# EAGLE design exixe14 (EAGLE 8.3.2)
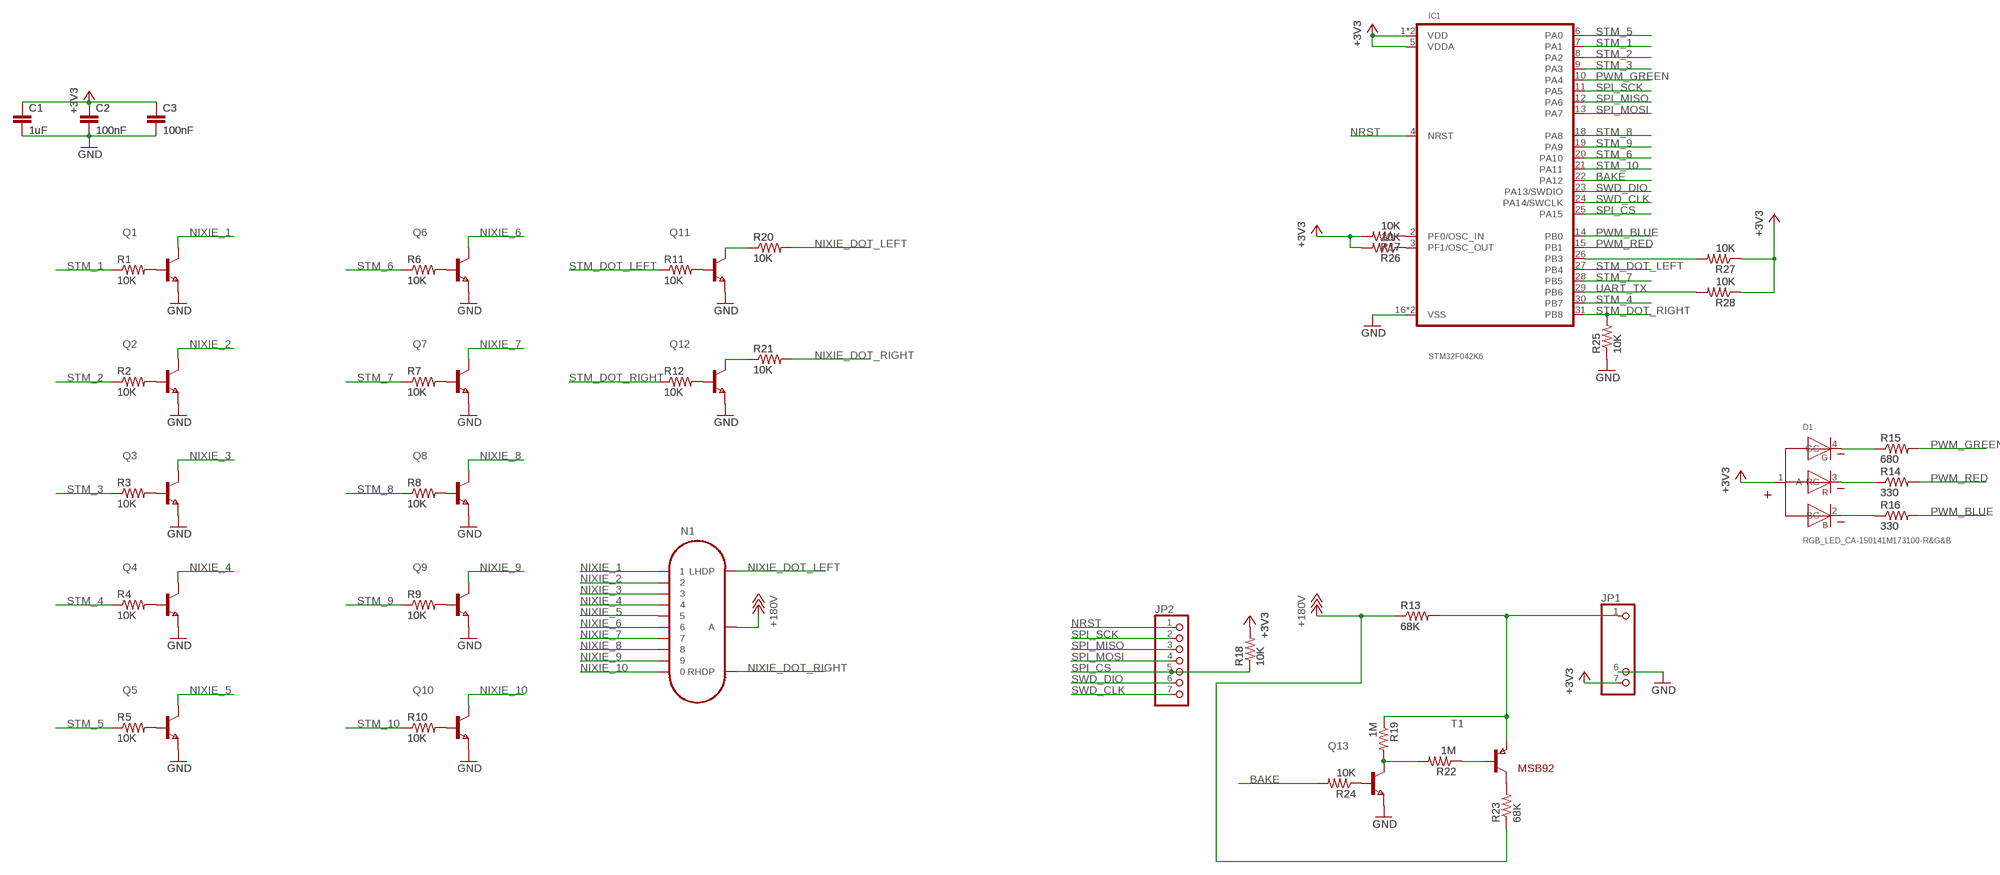
[diagram p0: schematic, sheet 1]

## Parts
C1  1uF  CAP0805  [0805]
C2  100nF  CAP0805  [0805]
C3  100nF  CAP0805  [0805]
D1  RGB_LED_CA-150141M173100-R&G&B  [3528-COMMON-ANODE]
IC1  STM32F042K6  [TQFP32-08]
JP1  PINHD-1X7  [1X07]
JP2  PINHD-1X7  [1X07]
N1  IN-14  [IN-14]
Q1  BF820  [SOT323]
Q2  BF820  [SOT323]
Q3  BF820  [SOT323]
Q4  BF820  [SOT323]
Q5  BF820  [SOT323]
Q6  BF820  [SOT323]
Q7  BF820  [SOT323]
Q8  BF820  [SOT323]
Q9  BF820  [SOT323]
Q10  BF820  [SOT323]
Q11  BF820  [SOT323]
Q12  BF820  [SOT323]
Q13  BF820  [SOT323]
R1  10K  RESISTOR0805-RES  [0805]
R2  10K  RESISTOR0805-RES  [0805]
R3  10K  RESISTOR0805-RES  [0805]
R4  10K  RESISTOR0805-RES  [0805]
R5  10K  RESISTOR0805-RES  [0805]
R6  10K  RESISTOR0805-RES  [0805]
R7  10K  RESISTOR0805-RES  [0805]
R8  10K  RESISTOR0805-RES  [0805]
R9  10K  RESISTOR0805-RES  [0805]
R10  10K  RESISTOR0805-RES  [0805]
R11  10K  RESISTOR0805-RES  [0805]
R12  10K  RESISTOR0805-RES  [0805]
R13  68K  RESISTOR0805-RES  [0805]
R14  330  RESISTOR0805-RES  [0805]
R15  680  RESISTOR0805-RES  [0805]
R16  330  RESISTOR0805-RES  [0805]
R17  10K  RESISTOR0805-RES  [0805]
R18  10K  RESISTOR0805-RES  [0805]
R19  1M  RESISTOR0805-RES  [0805]
R20  10K  RESISTOR0805-RES  [0805]
R21  10K  RESISTOR0805-RES  [0805]
R22  1M  RESISTOR0805-RES  [0805]
R23  68K  RESISTOR0805-RES  [0805]
R24  10K  RESISTOR0805-RES  [0805]
R25  10K  RESISTOR0805-RES  [0805]
R26  10K  RESISTOR0805-RES  [0805]
R27  10K  RESISTOR0805-RES  [0805]
R28  10K  RESISTOR0805-RES  [0805]
T1  PNPSOT323  [SOT323]

## Nets
+3V3: C1.1 C2.1 C3.1 D1.1(A) IC1.1(VDD) IC1.5(VDDA) IC1.17(VDD) JP1.7 R17.2 R18.2 R26.2 R27.1 R28.1
+180V: N1.A R13.1 R23.1
BAKE: IC1.22(PA12) R24.2
GND: C1.2 C2.2 C3.2 IC1.16(VSS) IC1.32(VSS) JP1.6 Q1.2(E) Q2.2(E) Q3.2(E) Q4.2(E) Q5.2(E) Q6.2(E) Q7.2(E) Q8.2(E) Q9.2(E) Q10.2(E) Q11.2(E) Q12.2(E) Q13.2(E) R25.1
N$1: Q1.1(B) R1.2
N$2: IC1.2(PF0/OSC_IN) R17.1
N$3: D1.4(GC) R15.1
N$4: Q2.1(B) R2.2
N$5: Q3.1(B) R3.2
N$6: Q4.1(B) R4.2
N$7: Q5.1(B) R5.2
N$8: Q6.1(B) R6.2
N$9: Q7.1(B) R7.2
N$10: Q8.1(B) R8.2
N$11: Q9.1(B) R9.2
N$12: Q10.1(B) R10.2
N$13: Q11.1(B) R11.2
N$14: Q12.1(B) R12.2
N$15: D1.3(RC) R14.1
N$16: IC1.3(PF1/OSC_OUT) R26.1
N$17: Q12.3(C) R21.1
N$18: Q11.3(C) R20.1
N$19: JP1.1 R13.2 R19.1 T1.3(E)
N$20: R22.1 T1.2(B)
N$21: D1.2(BC) R16.1
N$22: Q13.3(C) R19.2 R22.2
N$23: Q13.1(B) R24.1
N$24: R23.2 T1.1(C)
N$25: IC1.26(PB3) R27.2
NIXIE_1: N1.1 Q1.3(C)
NIXIE_2: N1.2 Q2.3(C)
NIXIE_3: N1.3 Q3.3(C)
NIXIE_4: N1.4 Q4.3(C)
NIXIE_5: N1.5 Q5.3(C)
NIXIE_6: N1.6 Q6.3(C)
NIXIE_7: N1.7 Q7.3(C)
NIXIE_8: N1.8 Q8.3(C)
NIXIE_9: N1.9 Q9.3(C)
NIXIE_10: N1.0 Q10.3(C)
NIXIE_DOT_LEFT: N1.LHDP R20.2
NIXIE_DOT_RIGHT: N1.RHDP R21.2
NRST: IC1.4(NRST) JP2.1
PWM_BLUE: IC1.14(PB0) R16.2
PWM_GREEN: IC1.10(PA4) R15.2
PWM_RED: IC1.15(PB1) R14.2
SPI_CS: IC1.25(PA15) JP2.5 R18.1
SPI_MISO: IC1.12(PA6) JP2.3
SPI_MOSI: IC1.13(PA7) JP2.4
SPI_SCK: IC1.11(PA5) JP2.2
STM_1: IC1.7(PA1) R1.1
STM_2: IC1.8(PA2) R2.1
STM_3: IC1.9(PA3) R3.1
STM_4: IC1.30(PB7) R4.1
STM_5: IC1.6(PA0) R5.1
STM_6: IC1.20(PA10) R6.1
STM_7: IC1.28(PB5) R7.1
STM_8: IC1.18(PA8) R8.1
STM_9: IC1.19(PA9) R9.1
STM_10: IC1.21(PA11) R10.1
STM_DOT_LEFT: IC1.27(PB4) R11.1
STM_DOT_RIGHT: IC1.31(PB8) R12.1 R25.2
SWD_CLK: IC1.24(PA14/SWCLK) JP2.7
SWD_DIO: IC1.23(PA13/SWDIO) JP2.6
UART_TX: IC1.29(PB6) R28.2

## Notes on the sheet
- MSB92

## Library data of the parts
C1-C3 = joyAnalog:CAP: Capacitor Standard 0603 ceramic capacitor, and 0.1" leaded capacitor.
D1 = nixx:RGB_LED_CA: SMD full-color TOP LED Characteristics Low energy consumption High reliability Low current requirement Fast switching No UV/IR radiation High brightness RGB individual control Compact package outline Black surface Applications Flash light Switch indicators Equipments indicators Accent and decorative lighting Electronic signage Video displays Backlight for LCDs, PDAs and TVs Oven, microwave Street lighting Ideal for lateral coupling in light guides <http://katalog.we-online.de/media/images/eipal/WL-SFTW_pf2.jpg> Details see: http://katalog.we-online.de/en/led/WL-SFTW?m Updated 2015-04-10 2015 (C) Wurth Elektronik
IC1 = nixx:STM32F042K6
JP1 = nixx:PINHD-1X7: PIN HEADER
JP2 = pinhead:PINHD-1X7: PIN HEADER
N1 = russian-nixies:IN-14: IN-14: medium numeric frontview nixie tube
Q1-Q13 = nixx:BF820: NPN TRANSISTOR
R1-R28 = joyAnalog:RESISTOR: Resistor Basic schematic elements and footprints for 0603, 1206, and PTH resistors.
T1 = zetex:PNPSOT323: PNP TRANSISTOR; MPN: 2DB1689-7; OC_FARNELL: 1710698; OC_NEWARK: 25R5667

## Board
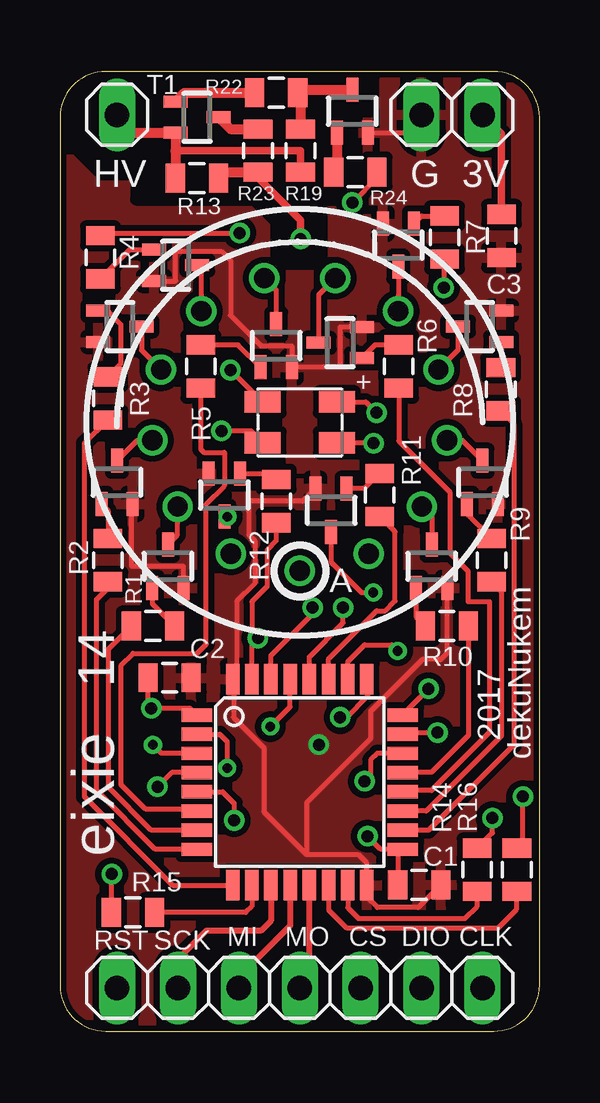
[diagram p1: board, top side]
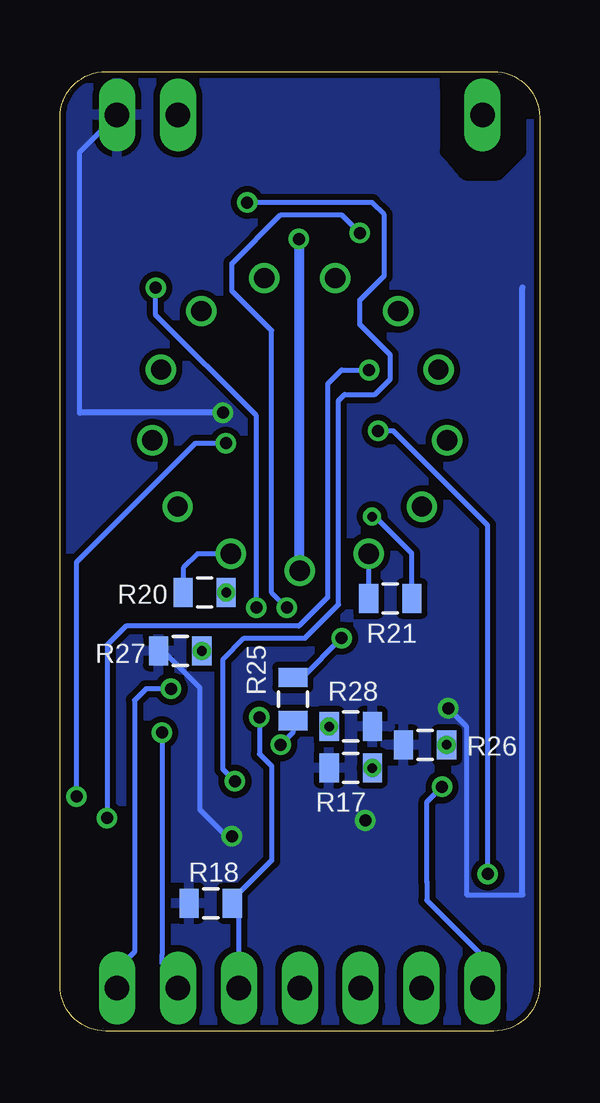
[diagram p2: board, bottom side, seen from below]

Size 20 x 40 mm. Coordinates in mm from the lower left corner, seen from the top.
Outline: 0,38.09 0,1.91 arc90 1.91,0 18.09,0 arc90 20,1.91 20,38.09 arc90 18.09,40 1.91,40 arc90 0,38.09
Copper layers (1*16): Top 0.035mm / dielectric 1.5mm / Bottom 0.035mm
Design rules "SparkFun-2-layer-TIGHT *": minimum track width 7mil, minimum drill 15mil, track to track 7mil, track to pad 7mil, pad to pad 7mil, via to via 7mil, smd to smd 0mil, copper to edge 7mil, drill to drill 7mil, minimum pad ring 7mil, minimum via ring 7mil, stop-mask expansion 4mil, vias tented up to drill 25mil, thermal gap 10mil
tRestrict: area 0.9,35.8 to 3.8,39.8; area 8.9,18.3 to 11.3,21.5; area 3.2,34.7 to 12.2,40; area 9,32 to 10.9,35.2; area 11.6,38.4 to 13.1,39.8; area 7.8,33.5 to 9.3,35.4
bRestrict: area 0.9,35.8 to 3.8,39.8; area 9.3,18.5 to 10.9,33.1

### Footprints (pad centres in the part's own frame; a part is rotated, then mirrored left to right if it is on the bottom)
0805 = smd 0.8 x 1.2: 1 -0.9,0; 2 0.9,0
3528-COMMON-ANODE = smd 1.5 x 0.9: 1 1.55,0.85; 2 1.55,-0.85; 3 -1.55,0.85; 4 -1.55,-0.85
TQFP32-08 = smd 1.27 x 0.559: 1 -4.293,2.8; 2 -4.293,2; 3 -4.293,1.2; 4 -4.293,0.4; 5 -4.293,-0.4; 6 -4.293,-1.2; 7 -4.293,-2; 8 -4.293,-2.8; 17 4.293,-2.8; 18 4.293,-2; 19 4.293,-1.2; 20 4.293,-0.4; 21 4.293,0.4; 22 4.293,1.2; 23 4.293,2; 24 4.293,2.8 | smd 0.559 x 1.27: 9 -2.8,-4.293; 10 -2,-4.293; 11 -1.2,-4.293; 12 -0.4,-4.293; 13 0.4,-4.293; 14 1.2,-4.293; 15 2,-4.293; 16 2.8,-4.293; 25 2.8,4.293; 26 2,4.293; 27 1.2,4.293; 28 0.4,4.293; 29 -0.4,4.293; 30 -1.2,4.293; 31 -2,4.293; 32 -2.8,4.293
1X07 = drill 1.016 long: 1 -7.62,0; 6 5.08,0; 7 7.62,0
1X07' = drill 1.016 long: 1 -7.62,0; 2 -5.08,0; 3 -2.54,0; 4 0,0; 5 2.54,0; 6 5.08,0; 7 7.62,0
IN-14 = drill 0.84: 0 5.094,-3.516; 1 -5.094,-3.516; 2 -6.145,-0.746; 3 -5.788,2.195; 4 -4.105,4.633; 5 -1.481,6.01; 6 1.481,6.01; 7 4.105,4.633; 8 5.788,2.195; 9 6.145,-0.746; A 0,-6.19; LHDP 2.877,-5.481; RHDP -2.877,-5.481
SOT323 = smd 0.5 x 1: 1 -0.65,-0.9; 2 0.65,-0.9; 3 0,0.9
SOT323' = smd 0.5 x 1: 1 0,0.9; 2 -0.65,-0.9; 3 0.65,-0.9

### Placement (x,y rotation side)
C1  14.99,6.1 0 top
C2  4.57,14.73 0 top
C3  18.41,33.15 270 top
D1  10,25.38 0 top
IC1  10,10.38 0 top
JP1  10,38.2 0 top
JP2  [1X07']  10,1.8 0 top
N1  10,25.38 0 top
Q1  4.5,19.38 0 top
Q2  2.38,22.88 0 top
Q3  2.5,29.38 270 top
Q4  4.83,31.92 270 top
Q5  9.02,28.57 0 top
Q6  11.68,28.7 90 top
Q7  14.11,32.77 180 top
Q8  17.5,29.38 90 top
Q9  17.62,22.88 0 top
Q10  15.5,19.38 0 top
Q11  11.3,21.72 180 top
Q12  6.86,22.35 180 top
Q13  12.19,38.35 0 top
R1  3.88,16.89 0 top
R2  2,19.64 90 top
R3  2,26.38 90 top
R4  1.69,32.26 270 top
R5  5.87,27.71 90 top
R6  14.13,27.71 90 top
R7  16.04,33.08 90 top
R8  18.38,26.76 90 top
R9  18,19.64 90 top
R10  16.14,16.89 180 top
R11  13.34,22.35 90 top
R12  9.02,22.1 90 top
R13  5.71,35.56 180 top
R14  17.4,6.73 270 top
R15  3.05,4.95 0 top
R16  19.05,6.73 270 top
R17  7.87,10.97 180 bottom
R18  13.72,5.33 180 bottom
R19  10.03,36.7 90 top
R20  13.97,18.29 180 bottom
R21  6.22,18.03 180 bottom
R22  9.02,39.12 0 top
R23  8.26,36.7 90 top
R24  12.32,35.81 0 top
R25  10.29,13.84 90 bottom
R26  4.78,11.94 180 bottom
R27  14.99,15.85 0 bottom
R28  7.87,12.7 180 bottom
T1  [SOT323']  5.71,38.1 270 top

### Tracks (layer width: path | path; a pad name or v marks a point on that pad's centre or on a via)
+3V3  (via drill 0.5)
  Top 0.203: D1.1 12.76,26.23 v13.21,25.78 | C1.1 14.09,7.37 IC1.17 13.37,7.58 v12.83,8.13 | 3.68,14.72 C2.1 3.67,13.6 v3.81,13.46 5.43,13.46 IC1.1 | IC1.5 6.78,9.98 7.26,9.5 v7.26,8.79
  Top 0.305: JP1.7 18.41,37.41 C3.1
  Bottom 0.203: v3.81,13.46 3.05,12.7 3.05,5.69 0.71,5.69 | JP1.7 19.18,36.64 19.18,25.78 | v12.83,8.13 13.06,8.13 14.17,9.25 14.17,14.33 15.7,15.85 R27.1
  Bottom 0.254: v13.21,25.78 19.18,25.78 | 0.71,5.69 0.71,31
  pour Bottom (isolate 0.254): 0,40 20,40 20,0 0,0
+180V  (via drill 0.5)
  Top 0.305: R23.1 8.26,35.59 10.03,33.81 v10.03,33.02
  Top 0.406: R13.1 6.86,35.8 R23.1
  Bottom 0.305: 10.03,19.22 N1.A
  Bottom 0.406: v10.03,33.02 10.03,19.22
BAKE  (via drill 0.5)
  Top 0.203: IC1.22 13.23,11.58 12.95,11.3 12.95,10.67 v12.7,10.41 | R24.2 13.22,35.57 v12.19,34.54
  Bottom 0.203: v12.7,10.41 13.21,10.92 13.21,15.49 12.32,16.38 9.78,16.38 8.38,17.78 8.38,26.29 8.13,26.54 6.86,26.54 6.22,27.18 6.22,28.19 7.49,29.46 7.49,30.48 6.48,31.5 6.48,34.04 6.99,34.54 v12.19,34.54
GND  (via drill 0.5)
  Top 0.203: C1.2 14.95,5.16 13.23,5.16 12.8,5.59 IC1.16 12.8,7.01 12.45,7.37 10.29,7.37 | 7.24,14.61 7.24,13.08 8.51,11.81 8.51,9.14 10.29,7.37 | 7.24,14.61 7.24,14.63 IC1.32 | Q10.2 16.13,18.46 16.13,15.75 15.88,15.49 15.11,15.49 12.95,13.34 12.95,12.19 10.29,9.53 10.29,7.37 | Q1.2 5.15,19.38 3,19.38 3,21.98 Q2.2 | Q4.2 4.83,31.27 4.83,32.51 6.73,32.51 7.11,32.13 7.11,29.84 8.38,28.57 9.67,28.57 Q5.2 11.68,27.69 11.68,29.35 Q6.2 | Q11.2 10.13,22.1 7.87,22.1 7.87,20.7 8.13,20.45 8.13,18.67 7.37,17.91 7.37,14.73 7.24,14.61 | Q13.2 14.33,37.45 JP1.6
  Bottom 0.203: R25.1 10.29,12.45 v10.79,11.94
  pour Top (isolate 0.254): 0,40 20,40 20,0 0,0
N$1
  Top 0.203: Q1.1 3.85,17.82 R1.2
N$2  (via drill 0.4)
  Top 0.203: IC1.2 6.67,12.38 6.97,12.08 R17.1
  other vias: 6.97,10.97
N$3  (via drill 0.5)
  Top 0.203: D1.4 7.96,25.02 v6.73,25.02 | R15.1 2.15,6.54 v2.16,6.55
  Bottom 0.203: v2.16,6.55 2.16,21.08 6.1,25.02 v6.73,25.02
N$4
  Top 0.203: Q2.1 2,21.71 R2.2
N$5
  Top 0.203: Q3.1 1.97,30.03 2.54,29.46 2.54,27.82 R3.2
N$6
  Top 0.203: R4.2 2.9,32.57 Q4.1
N$7
  Top 0.203: Q5.1 7.43,28.61 R5.2
N$8
  Top 0.203: R6.2 13.14,28.61 Q6.1
N$9
  Top 0.203: Q7.1 15.08,33.98 R7.2
N$10
  Top 0.203: Q8.1 18.4,27.68 R8.2
N$11
  Top 0.203: R9.2 16.97,21.57 Q9.1
N$12
  Top 0.203: Q10.1 14.85,17.27 R10.2
N$13
  Top 0.203: R11.2 12.7,22.62 Q11.1
N$14
  Top 0.203: Q12.1 8.76,23.25 R12.2
N$15  (via drill 0.5)
  Top 0.203: R14.1 18.03,8.27 v18.03,8.89 | v7.11,27.56 7.12,27.56 D1.3
  Bottom 0.203: v7.11,27.56 8.26,27.56 8.83,26.99 8.83,18.1 10.03,16.89 17.25,16.89 18.03,16.1 v18.03,8.89
N$16  (via drill 0.4)
  Top 0.203: IC1.3 4.23,11.58 R26.1
  other vias: 3.88,11.94
N$17  (via drill 0.4)
  Top 0.203: Q12.3 v6.99,21.45
  Bottom 0.203: R21.1 5.32,19.92 Q12.3 v6.99,21.45
N$18  (via drill 0.4)
  Top 0.203: Q11.3 11.3,19.56 12.57,18.29 R20.1
  other vias: 13.07,18.29
N$19
  Top 0.305: R19.1 10.03,36.7 4.82,36.7
  Top 0.406: R13.2 4.82,36.7 T1.3 2.68,37.45 2.38,37.75 JP1.1
N$20
  Top 0.406: T1.2 5.18,39.12 R22.1
N$21  (via drill 0.5)
  Top 0.203: D1.2 13.06,24.53 v13.08,24.51 | R16.1 19.3,7.88 v19.3,9.78
  Bottom 0.203: v19.3,9.78 19.3,19.56 14.35,24.51 v13.08,24.51
N$22
  Top 0.305: R22.2
  Top 0.406: R19.2 10.03,39 R22.2 10.05,39.25 Q13.3
N$23
  Top 0.406: Q13.1 11.54,35.94 R24.1
N$24
  Top 0.406: T1.1 7.11,37.6 R23.2
N$25  (via drill 0.4)
  Top 0.203: IC1.26 12,15.4 12.7,16.1 13.83,16.1 R27.2
  other vias: 14.09,15.85
NIXIE_1
  Top 0.203: Q1.3 4.91,20.69 N1.1
NIXIE_2
  Top 0.203: Q2.3 3.23,24.64 N1.2
NIXIE_3
  Top 0.203: Q3.3 3.4,28.39 N1.3
NIXIE_4
  Top 0.203: Q4.3 5.89,31.75 N1.4
NIXIE_5
  Top 0.203: N1.5 9.02,30.89 Q5.3
NIXIE_6
  Top 0.203: N1.6 10.78,30.69 Q6.3
NIXIE_7
  Top 0.203: Q7.3 N1.7
NIXIE_8
  Top 0.203: Q8.3 16.6,28.39 N1.8
NIXIE_9
  Top 0.203: Q9.3 16.77,24.64 N1.9
NIXIE_10
  Top 0.203: N1.0 15.5,21.46 Q10.3
NIXIE_DOT_LEFT
  Bottom 0.203: N1.LHDP 14.26,19.9 14.86,19.3 R20.2
NIXIE_DOT_RIGHT
  Bottom 0.203: R21.2 N1.RHDP | N1.RHDP
NRST  (via drill 0.5)
  Top 0.203: v4.06,10.19 4.66,10.78 IC1.4
  Bottom 0.203: JP2.1 2.38,3.14 4.7,5.46 4.7,6.21 4.69,6.22 4.69,9.56 v4.06,10.19
PWM_BLUE
  Top 0.203: IC1.14 11.2,5.06 11.94,4.32 18.29,4.32 19.05,5.08 R16.2
PWM_GREEN
  Top 0.203: IC1.10 8,5.21 7.75,4.95 R15.2
PWM_RED
  Top 0.203: IC1.15 12,5.14 12.45,4.7 16.89,4.7 17.4,5.21 R14.2
SPI_CS  (via drill 0.5)
  Top 0.203: IC1.25 12.83,14.65 12.83,13.97 11.94,13.08 v11.68,13.08
  Bottom 0.203: JP2.5 12.54,5.06 R18.1 12.82,5.47 11.18,7.11 11.18,11.05 11.68,11.56 v11.68,13.08
SPI_MISO
  Top 0.254: IC1.12 9.6,4.39 7.49,2.29 7.49,1.83 JP2.3
SPI_MOSI
  Top 0.254: IC1.13 10.4,2.65 10,2.25 JP2.4
SPI_SCK
  Top 0.203: JP2.2 4.92,3.02 4.95,3.05
  Top 0.254: IC1.11 8.8,4.61 8.38,4.19 6.1,4.19 4.95,3.05
STM_1
  Top 0.203: IC1.7 3.81,8.38 2.03,10.16 2.03,15.94 R1.1
STM_2
  Top 0.203: IC1.8 3.98,7.58 1.52,10.03 1.52,18 2,18.48 R2.1
STM_3
  Top 0.203: R3.1 1.02,24.5 1.02,9.78 4.71,6.09 IC1.9
STM_4  (via drill 0.5)
  Top 0.203: R4.1 1.69,33.27 v7.49,33.27 | IC1.30 8.8,15.66 10.54,17.4 v10.54,17.65
  Bottom 0.203: v10.54,17.65 11.18,18.29 11.18,29.21 12.83,30.86 12.83,32 10.79,34.04 8.26,34.04 v7.49,33.27
STM_5
  Top 0.203: IC1.6 5.62,9.27 3.56,9.27 2.54,10.29 2.54,15.24 3.05,15.75 5.71,15.75 6.1,16.13 6.1,21.97 6.86,22.73 6.86,24.13 6,24.13 5.87,24.26 R5.1
STM_6
  Top 0.203: IC1.20 14.35,10.03 15.49,10.03 17.91,12.45 17.91,17.91 17.02,17.91 17.02,19.18 16.26,19.94 16.26,22.48 14.13,24.61 R6.1
STM_7  (via drill 0.5)
  Top 0.203: R7.1 16,32.15 v16,30.99 | IC1.28 10.4,15.61 11.81,17.02 v11.81,17.65
  Bottom 0.203: v11.81,17.65 11.81,25.65 16,29.84 v16,30.99
STM_8
  Top 0.203: IC1.18 15.37,8.38 18.92,11.94 18.92,25.32 R8.1
STM_9
  Top 0.203: R9.1 18.41,18.32 18.41,12.32 15.28,9.18 IC1.19
STM_10
  Top 0.203: R10.1 17.04,12.34 15.49,10.79 14.31,10.79 IC1.21
STM_DOT_LEFT
  Top 0.203: R11.1 13.97,20.83 13.97,17.93 13.56,17.53 13.21,17.53 11.2,15.52 IC1.27
STM_DOT_RIGHT  (via drill 0.5)
  Top 0.203: R12.1 9.02,20.45 8.64,20.07 8.64,18.54 8,17.91 8,16.64 v8.26,16.38 8,16.13 IC1.31
  Bottom 0.203: R25.2 9.89,14.74 v8.26,16.38
SWD_CLK  (via drill 0.5)
  Top 0.203: IC1.24 14.29,13.2 v15.37,14.28
  Bottom 0.203: JP2.7 17.62,2.57 16.89,3.3 16.89,13.79 16.41,14.28 v15.37,14.28
SWD_DIO  (via drill 0.5)
  Top 0.203: IC1.23 14.36,12.45 v15.75,12.45
  Bottom 0.203: v15.75,12.45 15.75,3.17 15.75,2.85 15.08,2.18 JP2.6
UART_TX  (via drill 0.4)
  Top 0.203: R28.2 9.6,13.53 IC1.29
  other vias: 8.77,12.7

### Text on the board
tNames: HV | G | 3V | + | A | dekuNukem | 2017 | 14 | eixie | MI | MO | CS | DIO | CLK | RST | SCK